# EasyEDA Pro project ProPrj_balance_vehicle_2024-12-19.epro, schematic balance_vehicle

## Sheets
1 balance_vehicle_P1: Board Name: Board1; Create Date: 2024-12-16; Page Name: balance_vehicle_P1; Project Name: balance_vehicle; Schematic Name: balance_vehicle; Update Date: 2024-12-17; Company: 嘉立创EDA; Page Size: A4; Version: V1.0
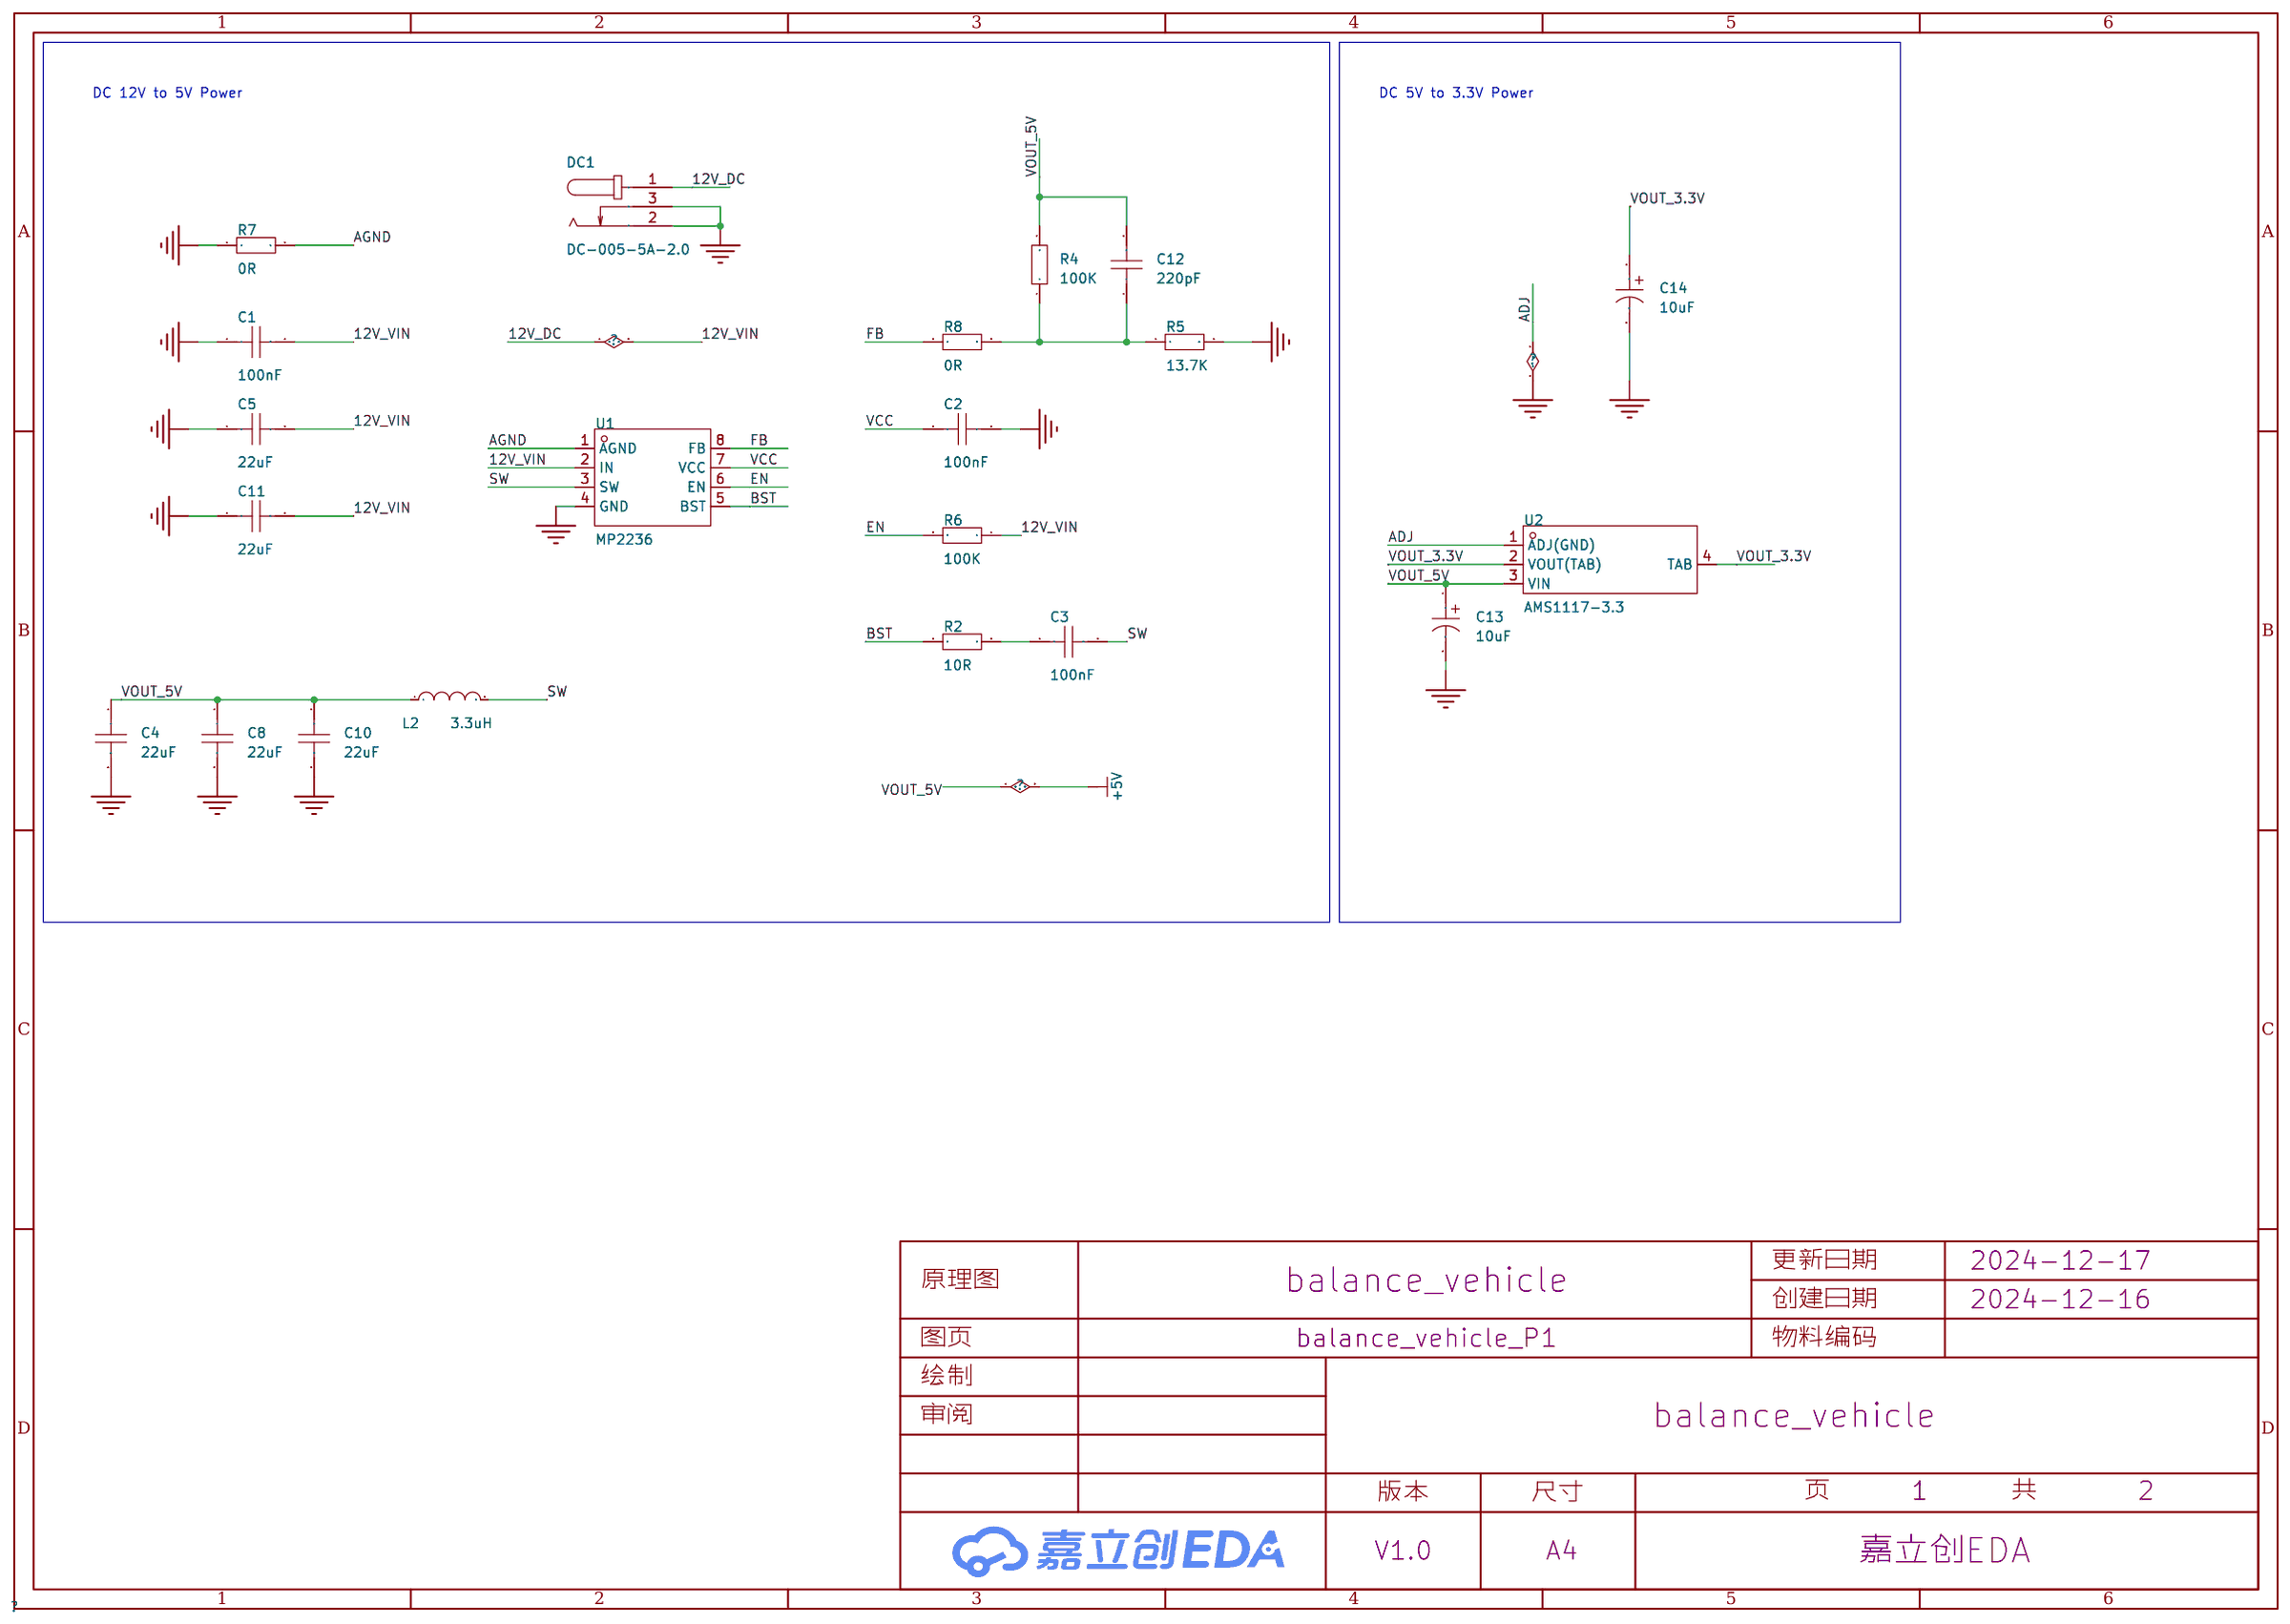
[diagram p0: balance_vehicle_P1]
2 balance_vehicle_P2: Page Name: balance_vehicle_P2; Update Date: 2024-12-18
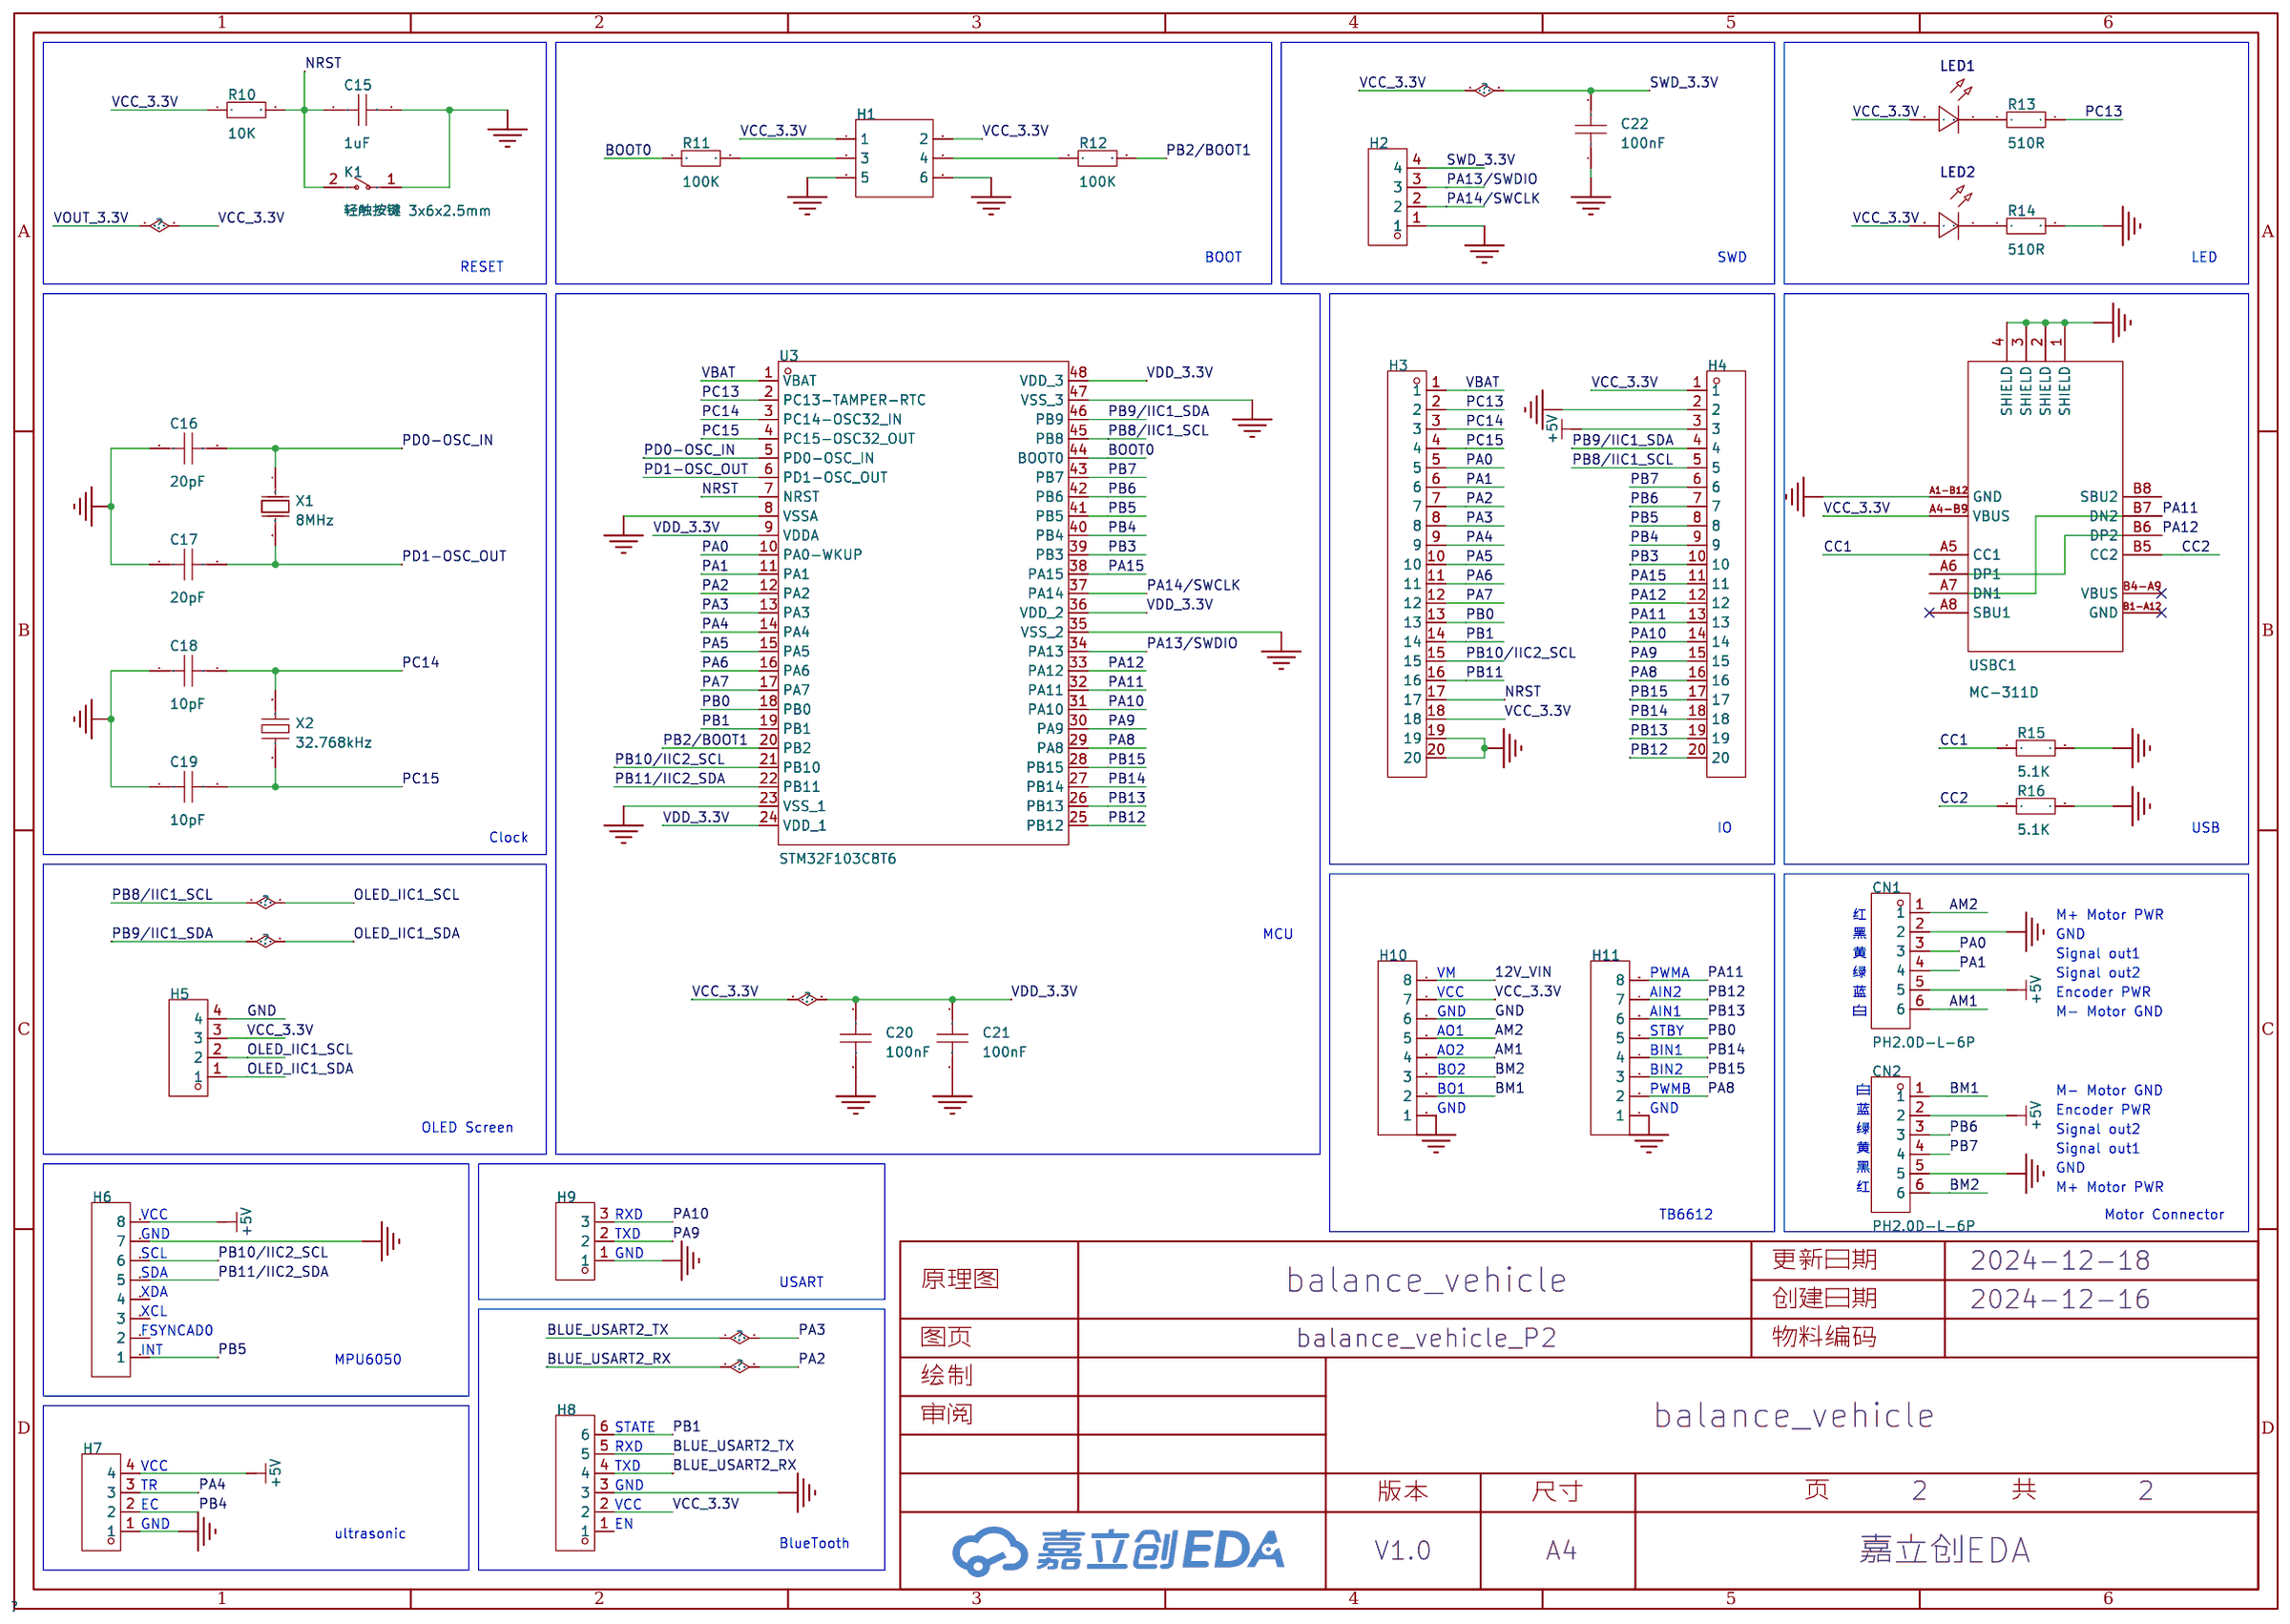
[diagram p1: balance_vehicle_P2]

## Parts
sheet balance_vehicle_P1
C1  100nF  [C0805]
C2  100nF  [C0805]
C3  100nF  [C0805]
C4  22uF  [C0805]
C5  22uF  [C0805]
C8  22uF  [C0805]
C10  22uF  [C0805]
C11  22uF  [C0805]
C12  220pF  [C0805]
C13  10uF  [CAP-SMD_L2.0-W1.3-FD]
C14  10uF  [CAP-SMD_L2.0-W1.3-FD]
DC1  DC-005-5A-2.0  [DC-IN-TH_DC-005-5A-2.0]
L2  3.3uH  [IND-SMD_L7.1-W6.6_MJC-0603T]
R2  10R  [R0805]
R4  100K  [R0805]
R5  13.7K  [R0805]
R6  100K  [R0805]
R7  0R  [R0805]
R8  0R  [R0805]
U1  MP2236  [SOT-23-8_L3.0-W1.7-P0.65-LS2.8-BL]
U2  AMS1117-3.3  [SOT-223-4_L6.5-W3.5-P2.30-LS7.0-BR]
sheet balance_vehicle_P2
C15  1uF  [C0603]
C16  20pF  [C0603]
C17  20pF  [C0603]
C18  10pF  [C0603]
C19  10pF  [C0603]
C20  100nF  [C0603]
C21  100nF  [C0603]
C22  100nF  [C0603]
CN1  PH2.0D-L-6P  [CONN-TH_6P_PH2.0D-L-6P]
CN2  PH2.0D-L-6P  [CONN-TH_6P_PH2.0D-L-6P]
H1  -  [HDR-TH_6P-P2.54-V-R2-C3-S2.54_A2541WV-2X3P]
H2  -  [HDR-TH_4P-P2.54-V-M]
H3  -  [HDR-TH_20P-P2.54-V-M-1]
H4  -  [HDR-TH_20P-P2.54-V-M-1]
H5  -  [hdr-th_4p-p2.54-v-f]
H6  -  [HDR-TH_8P-P2.54-V-F-1]
H7  -  [hdr-th_4p-p2.54-v-f]
H8  -  [hdr-th_6p-p2.54-v-f]
H9  -  [HDR-TH_3P-P2.54-V-M]
H10  -  [HDR-TH_8P-P2.54-V-F-1]
H11  -  [HDR-TH_8P-P2.54-V-F-1]
K1  轻触按键 3x6x2.5mm  [SW-SMD_L6.1-W3.7-LS8.0]
LED1  -  [LED_0603]
LED2  -  [LED_0603]
R10  10K  [R0603]
R11  100K  [R0603]
R12  100K  [R0603]
R13  510R  [R0603]
R14  510R  [R0603]
R15  5.1K  [R0603]
R16  5.1K  [R0603]
U3  STM32F103C8T6  [LQFP-48_L7.0-W7.0-P0.50-LS9.0-BL]
USBC1  MC-311D  [USB-C-SMD_MC-311D]
X1  8MHz  [CRYSTAL-SMD_L11.5-W4.8-LS12.7]
X2  32.768kHz  [OSC-SMD_L3.2-W1.5]

## Library data of the parts
C1-C5 C8 C10-C12 = CAP_0805: Supplier Footprint: 0805
C13 C14 = TMCP1A106MTRF: 容值:10uF;精度:±20%;额定电压:10V;等效串联电阻:5.9Ω@100kHz;; LCSC Part Name: 10uF ±20% 10V; Supplier Part: C1969735; Manufacturer: VISHAY(威世); Supplier Footprint: 0805; JLCPCB Part Class: 扩展库; Datasheet: https://atta.szlcsc.com/upload/public/pdf/source/20210506/EB7F77920409F8D63FFE94178A7159DC.pdf; Supplier: LCSC; Tolerance: ±20%; Rated Voltage: 10V; Equivalent Series Resistance(ESR): 5.9Ω@100kHz; Operating Temperature: -55℃~+125℃
DC1 = DC-005-5A-2.0: 连接器类型:DC电源插座;安装方式:弯插;触点内径:2mm;触点外径:6.2mm;额定电流:5A;额定电压:24V;工作温度范围:-20℃~+70℃;; LCSC Part Name: DC电源插座 内径:2mm 外径:6.2mm; Supplier Part: C381116; Manufacturer: XKB Connection(中国星坤); Supplier Footprint: 插件; JLCPCB Part Class: 扩展库; Datasheet: https://atta.szlcsc.com/upload/public/pdf/source/20211015/707A35F7AB6E89C57AAB641950105BB7.pdf; Supplier: LCSC; Connector Type: DC电源插座; Mounting Style: 弯插; Inside Contact Diameter: 2mm; Outside Contact Diameter: 6.2mm; Current Rating (Max): 5A; Voltage Rating (Max): 24V; Operating Temperature Range: -20℃~+70℃
L2 = CXP0630-5R6M-AG(5.6uh): 电感值:5.6uH;精度:±20%;额定电流:5.5A;饱和电流(Isat):7A;类型:一体成型电感;; LCSC Part Name: 5.6uH ±20% 7A; Supplier Part: C7461360; Manufacturer: DMBJ(振宝佳); Supplier Footprint: 0630; Datasheet: https://atta.szlcsc.com/upload/public/pdf/source/20230706/7F3A5B39C5AD80A91C9FA782B54A296B.pdf; Supplier: LCSC; Tolerance: ±20%; Rated Current: 5.5A; Saturation Current (Isat): 7A; DC Resistance (DCR): 42mΩ; Type: 一体成型电感
R2 R4-R8 = Res_0805: Supplier Footprint: 0805
U1 = MP2236: Supplier Part: C9900030582; Supplier Footprint: SOT23-8; JLCPCB Part Class: 扩展库; Supplier: LCSC
U2 = AMS1117-3.3_C347222: 输出类型:固定;最大输入电压:18V;输出电压:3.3V;输出电流:1A;电源纹波抑制比(PSRR):60dB@(120Hz);输出极性:正极;; LCSC Part Name: 输出:3.3V 电流:1A 耐压:12V; Supplier Part: C347222; Manufacturer: UMW(友台半导体); Supplier Footprint: SOT-223; JLCPCB Part Class: 扩展库; Datasheet: https://atta.szlcsc.com/upload/public/pdf/source/20231109/155D79A26D9DB04352555A58D5969DC8.pdf; Supplier: LCSC; Output Type: 固定; Maximum Input Voltage: 18V; Output Voltage: 3.3V; Output Current: 1A; Power Supply Rejection Ratio (PSRR): 60dB@(120Hz); Dropout Voltage: 1.3V@(1A); Feature: 过流保护(OCP); Output Polarity: 正极; Number of Outputs: 1
C15-C22 = CAP_0603: Supplier Footprint: 0603
CN1 CN2 = PH2.0D-L-6P: Supplier Part: C9900007791; Supplier Footprint: PH-6A(RED); JLCPCB Part Class: 扩展库; Supplier: LCSC
H1 = HDR-M_2.54_2x3: Supplier Part: C402781; Supplier Footprint: 插件,P=2.54mm
H2 = HDR-M_2.54_1x4P: Supplier Part: C492403; Supplier Footprint: 插件
H3 H4 = HDR-M_2.54_1x20P: 间距:2.54mm;总PIN位数:20;排数:1;插针结构:-;行距:-;安装类型:直插;圆针/方针:-;额定电流:-;额定电压:-;配合针长度:-;塑高:-;触头材质:黄铜;触头镀层:-;颜色:黑色;; Supplier Part: C50981; Supplier Footprint: 插件
H5 H7 = HDR-F_2.54_1x4P: Supplier Part: C2718488; Supplier Footprint: 插件
H6 H10 H11 = HDR-F_2.54_1x8P: Supplier Part: C27438; Supplier Footprint: 插件
H8 = HDR-F_2.54_1x6P: Supplier Part: C40877; Supplier Footprint: 插件
H9 = HDR-M_2.54_1x3P: Supplier Part: C2937625; Supplier Footprint: 插件
K1 = 轻触按键 3x6x2.5mm_C5116372: 开关长度:6.05mm;开关宽度:3.65mm;开关高度:2.5mm;机械寿命:-;; Supplier Part: C5116372; Manufacturer: BBJ; Supplier Footprint: SMD; JLCPCB Part Class: 扩展库; Datasheet: https://atta.szlcsc.com/upload/public/pdf/source/20220725/9B611EB1AF8F1817AB348C1FCD97BDC0.pdf; Supplier: LCSC; Switch Length: 6.05mm; Switch Width: 3.65mm; Switch Height: 2.5mm
LED1 = LED_0603-B: Supplier Footprint: 0603
LED2 = LED_0603-G: Supplier Footprint: 0603
R10-R16 = Res_0603: Supplier Footprint: 0603
U3 = STM32F103C8T6: CPU内核:ARM-M3;CPU最大主频:72MHz;应用领域:-;; LCSC Part Name: 主流增强型ARM Cortex-M3 MCU，具有64 KB Flash、72 MHz CPU、电机控制、USB和CAN; Supplier Part: C8734; Manufacturer: ST(意法半导体); Supplier Footprint: LQFP-48(7x7); JLCPCB Part Class: 扩展库; Datasheet: https://atta.szlcsc.com/upload/public/pdf/source/20220812/8363ACEC51AD55ECEB84799464F7CB85.pdf; Supplier: LCSC; CPU Core: ARM-M3; CPU Maximum Speed: 72MHz; Program Storage Size: 64KB; Program Memory Type: FLASH; GPIO Ports Number: 37; ADC (Bit): 12bit; Low Voltage Detection Threshold: 2V~3.6V
USBC1 = MC-311D: 连接器类型:Type-C;标准:-;公母:母;端口数量:1;触点数量:12P;; LCSC Part Name: Type-C 母; Supplier Part: C136423; Manufacturer: SOFNG(硕方); Supplier Footprint: SMD; JLCPCB Part Class: 扩展库; Datasheet: https://atta.szlcsc.com/upload/public/pdf/source/20200911/C136423_B6E9AB4DF8CDF4010F036AD62AD75C35.pdf; Supplier: LCSC; Connector Type: Type-C; Gender: 母; Number of Ports: 1; Number of Contacts: 12P
X1 = X49SM8MSD2SC: 晶振类型:贴片晶振;频率:8MHz;常温频差:±20ppm;外接负载电容:20pF;频率稳定度(全温):±30ppm;; LCSC Part Name: 8MHz ±20ppm 20pF; Supplier Part: C12674; Manufacturer: YXC(扬兴晶振); Supplier Footprint: HC-49S-SMD; JLCPCB Part Class: 基础库; Datasheet: https://atta.szlcsc.com/upload/public/pdf/source/20240329/3EBF42EBCAB50CA65B6FA9D7CFA1955A.pdf; Supplier: LCSC; Crystal Type: 贴片晶振; Normal temperature Frequency Tolerance: ±20ppm; External load capacitor: 20pF; Frequency Stability(Full temperature range): ±30ppm; Operating Temperature: -20℃~+70℃
X2 = Q13FC13500004: 晶振类型:贴片晶振;频率:32.768kHz;常温频差:±20ppm;外接负载电容:12.5pF;频率稳定度(全温):-;; LCSC Part Name: 32.768kHz ±20ppm 12.5pF; Supplier Part: C1669857; Manufacturer: EPSON(爱普生); Supplier Footprint: SMD3215-2P; JLCPCB Part Class: 扩展库; Datasheet: https://atta.szlcsc.com/upload/public/pdf/source/20211127/C2650476_CC369359C13F4A6248FBD5522D0F5ADF.pdf; Supplier: LCSC; Crystal Type: 贴片晶振; Normal temperature Frequency Tolerance: ±20ppm; External load capacitor: 12.5pF; Equivalent Series Resistance (ESR): 70kΩ; Operating Temperature: -40℃~+85℃

## Nets
12V_DC: C1.2 C5.2 C11.2 DC1.1 H10.8 R6.1 U1.2(IN)
+5V: C4.1 C8.1 C10.1 C12.2 C13.1 CN1.5 CN2.2 H4.3 H6.8 H7.4 L2.1 R4.2 U2.3(VIN)
AGND: R7.2 U1.1(AGND)
GND: C1.1 C2.2 C4.2 C5.1 C8.2 C10.2 C11.1 C13.2 C14.2 C15.2 C16.1 C17.1 C18.1 C19.1 C20.2 C21.2 C22.1 CN1.2 CN2.5 DC1.2 DC1.3 H1.5 H1.6 H2.1 H3.19 H3.20 H4.2 H5.4 H6.7 H7.1 H8.3 H9.1 H10.1 H10.6 H11.1 K1.1 R5.2 R7.1 R14.2 R15.2 R16.2 U1.4(GND) U2.1(ADJ(GND)) U3.8(VSSA) U3.23(VSS_1) U3.35(VSS_2) U3.47(VSS_3) USBC1.1(SHIELD) USBC1.2(SHIELD) USBC1.3(SHIELD) USBC1.4(SHIELD) USBC1.A1-B12(GND)
VBAT: H3.1 U3.1(VBAT)
VCC: C2.1 U1.7(VCC)
AM1: CN1.6 H10.4
AM2: CN1.1 H10.5
BLUE_USART2_RX: H3.7 H8.4 U3.12(PA2)
BLUE_USART2_TX: H3.8 H8.5 U3.13(PA3)
BM1: CN2.1 H10.2
BM2: CN2.6 H10.3
BOOT0: R11.1 U3.44(BOOT0)
BST: R2.1 U1.5(BST)
CC1: R15.1 USBC1.A5(CC1)
CC2: R16.1 USBC1.B5(CC2)
EN: R6.2 U1.6(EN)
FB: R8.1 U1.8(FB)
NRST: C15.1 H3.17 K1.2 R10.2 U3.7(NRST)
OLED_IIC1_SCL: H4.5 H5.2 U3.45(PB8)
OLED_IIC1_SDA: H4.4 H5.1 U3.46(PB9)
PA0: CN1.3 H3.5 U3.10(PA0-WKUP)
PA1: CN1.4 H3.6 U3.11(PA1)
PA4: H3.9 H7.3 U3.14(PA4)
PA5: H3.10 U3.15(PA5)
PA6: H3.11 U3.16(PA6)
PA7: H3.12 U3.17(PA7)
PA8: H4.16 H11.2 U3.29(PA8)
PA9: H4.15 H9.2 U3.30(PA9)
PA10: H4.14 H9.3 U3.31(PA10)
PA11: H4.13 H11.8 U3.32(PA11) USBC1.A7(DN1) USBC1.B7(DN2)
PA12: H4.12 U3.33(PA12) USBC1.A6(DP1) USBC1.B6(DP2)
PA13/SWDIO: H2.3 U3.34(PA13)
PA14/SWCLK: H2.2 U3.37(PA14)
PA15: H4.11 U3.38(PA15)
PB0: H3.13 H11.5 U3.18(PB0)
PB1: H3.14 H8.6 U3.19(PB1)
PB2/BOOT1: R12.2 U3.20(PB2)
PB3: H4.10 U3.39(PB3)
PB4: H4.9 H7.2 U3.40(PB4)
PB5: H4.8 H6.1 U3.41(PB5)
PB6: CN2.3 H4.7 U3.42(PB6)
PB7: CN2.4 H4.6 U3.43(PB7)
PB10/IIC2_SCL: H3.15 H6.6 U3.21(PB10)
PB11: H3.16
PB11/IIC2_SDA: H6.5 U3.22(PB11)
PB12: H4.20 H11.7 U3.25(PB12)
PB13: H4.19 H11.6 U3.26(PB13)
PB14: H4.18 H11.4 U3.27(PB14)
PB15: H4.17 H11.3 U3.28(PB15)
PC13: H3.2 R13.2 U3.2(PC13-TAMPER-RTC)
PC14: C18.2 H3.3 U3.3(PC14-OSC32_IN) X2.2
PC15: C19.2 H3.4 U3.4(PC15-OSC32_OUT) X2.1
PD0-OSC_IN: C16.2 U3.5(PD0-OSC_IN) X1.1(OSC1)
PD1-OSC_OUT: C17.2 U3.6(PD1-OSC_OUT) X1.2(OSC2)
SW: C3.2 L2.2 U1.3(SW)
SWD_3.3V: C14.1 C20.1 C21.1 C22.2 H1.1 H1.2 H2.4 H3.18 H4.1 H5.3 H8.2 H10.7 LED1.2(A) LED2.2(A) R10.1 U2.2(VOUT(TAB)) U2.4(TAB) U3.9(VDDA) U3.24(VDD_1) U3.36(VDD_2) U3.48(VDD_3) USBC1.A4-B9(VBUS)
$C3_1: C3.1 R2.2
$C12_1: C12.1 R4.1 R5.1 R8.2
$H1_3: H1.3 R11.2
$H1_4: H1.4 R12.1
$LED1_1: LED1.1(C) R13.1
$LED2_1: LED2.1(C) R14.1

Not connected (* = marked no-connect by the designer): H6 2 3 4; H8 1; USBC1 A8(SBU1)* B1-A12(GND)* B4-A9(VBUS)* B8(SBU2)

## Notes on the sheets
sheet 1
- DC 12V to 5V Power
- DC 5V to 3.3V Power
sheet 2
- RESET
- BOOT
- SWD
- LED
- Clock
- IO
- USB
- 红
- M+ Motor PWR
- MCU
- 黄
- 黑
- GND
- Signal out1
- VM
- PWMA
- 绿
- Signal out2
- VCC
- AIN2
- 蓝
- Encoder PWR
- GND
- AIN1
- 白
- M- Motor GND
- AO1
- STBY
- AO2
- BIN1
- BO1
- BO2
- BIN2
- PWMB
- 白
- M- Motor GND
- GND
- GND
- 蓝
- Encoder PWR
- OLED Screen
- 绿
- Signal out2
- 黄
- 黑
- GND
- Signal out1
- 红
- M+ Motor PWR
- VCC
- RXD
- TB6612
- Motor Connector
- GND
- TXD
- SCL
- SDA
- GND
- XDA
- USART
- XCL
- FSYNCAD0
- INT
- MPU6050
- STATE
- RXD
- VCC
- TXD
- TR
- GND
- EC
- GND
- EN
- VCC
- ultrasonic
- BlueTooth
